# EasyEDA Pro project MasterDesignFileRev2.epro, schematic Schematic1
Board Name: Board1; Create Date: 2025-04-22; Page Name: P1; Project Name: XBOX Console controller fitzgeraldlabs; Schematic Name: Schematic1; Update Date: 2025-04-30; Company: Gneiss Technologies; Drawed: Anik; Drawn: Anik; Page Size: A4; Part Number: GIL-0001; Reviewed: Gneiss Team; Version: V0.1
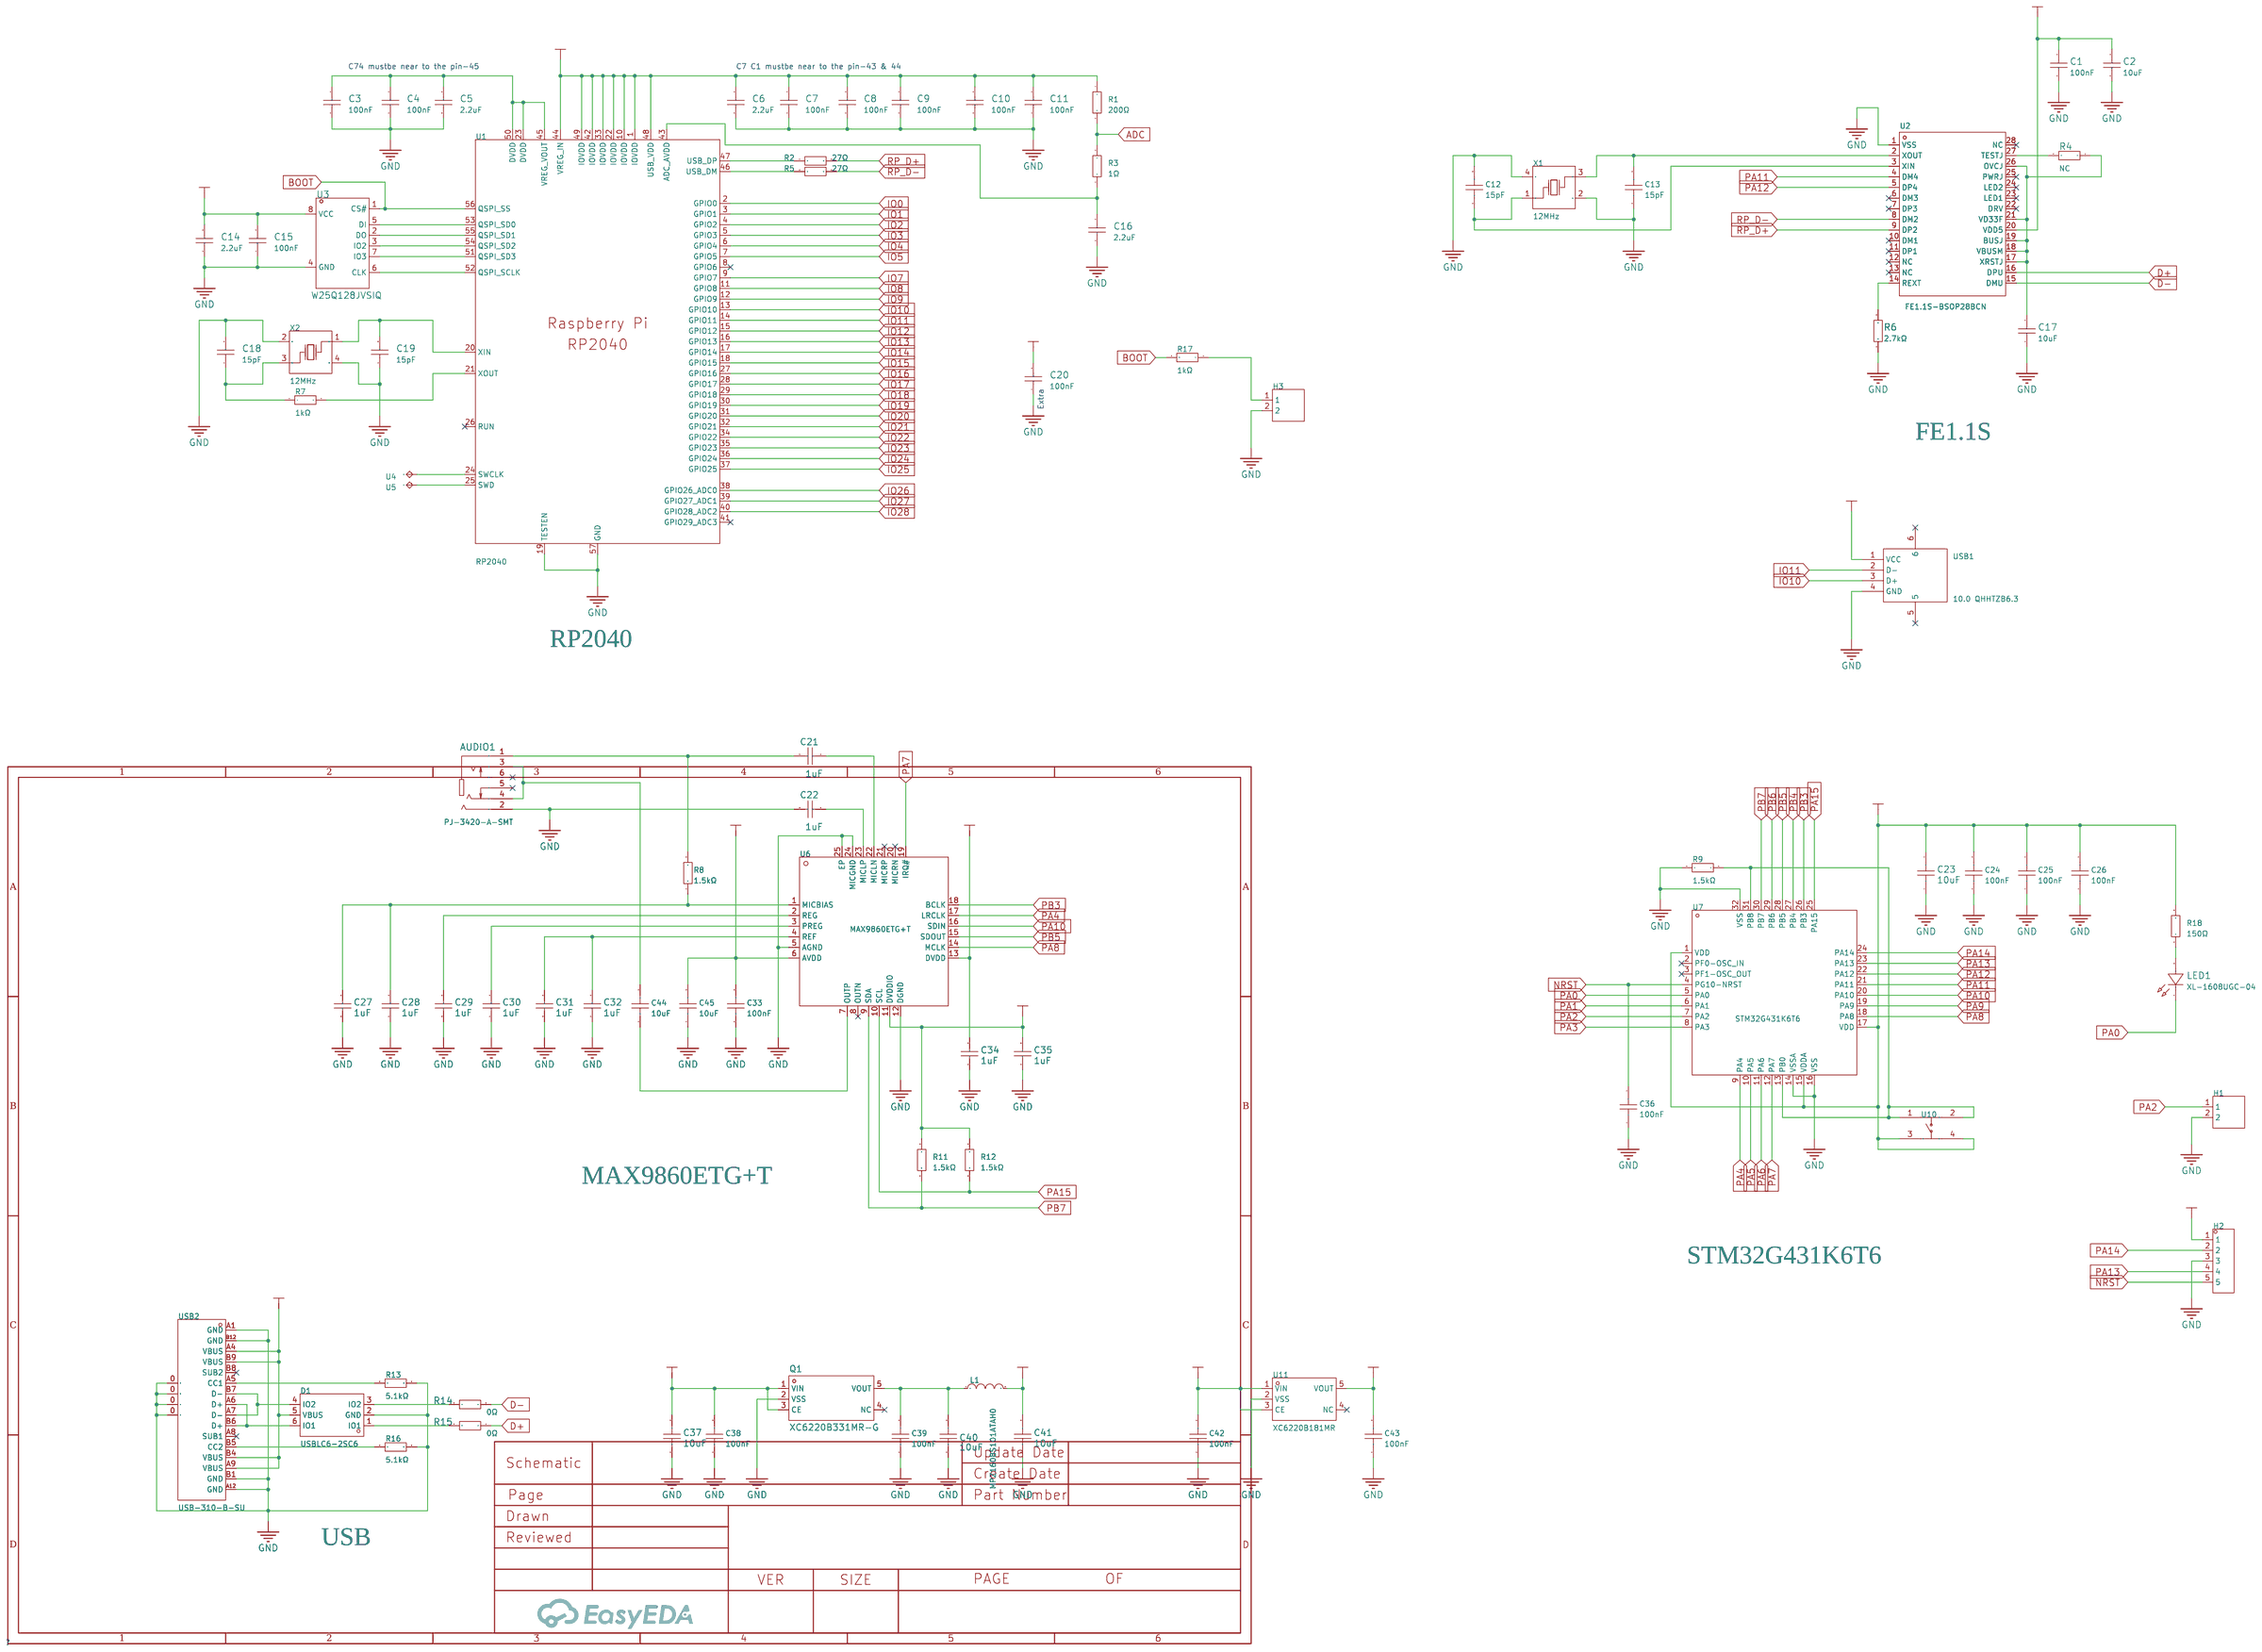
[diagram p0: schematic sheet]

## Parts
AUDIO1  PJ-3420-A-SMT  [AUDIO-SMD_PJ-3420-A-SMT_C319102]
C1  100nF  [C0402]
C2  10uF  [C0402]
C3  100nF  [C0402]
C4  100nF  [C0402]
C5  2.2uF  [C0402]
C6  2.2uF  [C0402]
C7  100nF  [C0402]
C8  100nF  [C0402]
C9  100nF  [C0402]
C10  100nF  [C0402]
C11  100nF  [C0402]
C12  15pF  [C0402]
C13  15pF  [C0402]
C14  2.2uF  [C0402]
C15  100nF  [C0402]
C16  2.2uF  [C0402]
C17  10uF  [C0402]
C18  15pF  [C0402]
C19  15pF  [C0402]
C20  100nF  [C0402]
C21  1uF  [C0402]
C22  1uF  [C0402]
C23  10uF  [C0805]
C24  100nF  [C0402]
C25  100nF  [C0402]
C26  100nF  [C0402]
C27  1uF  [C0402]
C28  1uF  [C0402]
C29  1uF  [C0402]
C30  1uF  [C0402]
C31  1uF  [C0402]
C32  1uF  [C0402]
C33  100nF  [C0402]
C34  1uF  [C0402]
C35  1uF  [C0402]
C36  100nF  [C0402]
C37  10uF  [C0805]
C38  100nF  [C0402]
C39  100nF  [C0402]
C40  10uF  [C0805]
C41  10uF  [C0805]
C42  100nF  [C0402]
C43  100nF  [C0402]
C44  10uF  [C0402]
C45  10uF  [C0402]
D1  USBLC6-2SC6  [SOT-23-6_L2.9-W1.6-P0.95-LS2.8-BL]
H1  -  [HDR-TH_2P-P2.54-V-M-1]  (no BOM)
H2  -  [HDR-TH_5P-P2.54-V-M]  (no BOM)
H3  -  [HDR-TH_2P-P2.54-V-M-1]  (no BOM)
L1  MPZ1608S101ATAH0  [L0603]
LED1  XL-1608UGC-04  [LED0603-RD_GREEN]
Q1  XC6220B331MR-G  [SOT-25_L3.0-W1.6-P0.95-LS2.8-TL]
R1  200Ω  [R0402]
R2  27Ω  [R0402]
R3  1Ω  [R0402]
R4  NC  [R0402]  (no BOM)
R5  27Ω  [R0402]
R6  2.7kΩ  [R0402]
R7  1kΩ  [R0402]
R8  1.5kΩ  [R0402]
R9  1.5kΩ  [R0402]
R11  1.5kΩ  [R0402]
R12  1.5kΩ  [R0402]
R13  5.1kΩ  [R0402]
R14  0Ω  [R0402]
R15  0Ω  [R0402]
R16  5.1kΩ  [R0402]
R17  1kΩ  [R0402]
R18  150Ω  [R0402]
U1  RP2040  [LQFN-56_L7.0-W7.0-P0.4-EP]
U2  FE1.1S-BSOP28BCN  [SSOP-28_L9.9-W3.9-P0.64-LS6.0-BL-1]
U3  W25Q128JVSIQ  [SOP-8_L5.3-W5.3-P1.27-LS8.0-BL]
U4  -  [test pad 1]
U5  -  [test pad 1]
U6  MAX9860ETG+T  [TQFN-24_L4.0-W4.0-P0.50-BL-EP]
U7  STM32G431K6T6  [LQFP-32_L7.0-W7.0-P0.80-LS9.0-BL]
U10  TSC4A 160gf-WZ 016  [KEY-SMD_TSC4A]
U11  XC6220B181MR  [SOT-23-5_L2.9-W1.6-P0.95-LS2.8-BR]
USB1  10.0 QHHTZB6.3  [USB-A-TH_10.0QHHTZB6.3]
USB2  USB-310-B-SU  [USB-C-SMD_20P-P0.50-L7.4-W8.9]
X1  12MHz  [OSC-SMD_4P-L3.2-W2.5-BL]
X2  12MHz  [OSC-SMD_4P-L3.2-W2.5-BL]

## Library data of the parts
AUDIO1 = PJ-3420-A-SMT: Connector Type:3.5mm耳机座 Current Rating (Max):500mA Voltage Rating (Max):30V Operating Temperature Range:-20℃~+70℃ Operating Temperature Range:-20℃~+70℃ Soldering Temperature(Max):235℃; LCSC Part Name: 3.5mm耳机座; Supplier Part: C319102; Manufacturer: XKB Connectivity(中国星坤); Supplier Footprint: SMD; JLCPCB Part Class: Extended Part; Datasheet: https://atta.szlcsc.com/upload/public/pdf/source/20211015/FA11597DF53DC331FB6A72D64BA50234.pdf; Supplier: LCSC; Connector Type: 3.5mm耳机座; Current Rating (Max): 500mA; Voltage Rating (Max): 30V; Operating Temperature Range: -20℃~+70℃; Soldering Temperature(Max): 235℃
C1 C3 C4 C7-C11 C15 C20 C24-C26 C33 C36 C38 C39 C42 C43 = CL05B104KO5NNNC: Capacitance: Tolerance:±10% Tolerance:±10% Voltage Rated: Temperature Coefficient:; LCSC Part Name: 100nF ±10% 16V; Supplier Part: C1525; Manufacturer: SAMSUNG(三星); Supplier Footprint: 0402; JLCPCB Part Class: Basic Part; Datasheet: https://atta.szlcsc.com/upload/public/pdf/source/20160218/1457707763339.pdf; Supplier: LCSC; Tolerance: ±10%
C2 C17 = CL05A106MQ5NUNC: Capacitance: Tolerance:±20% Tolerance:±20% Voltage Rated: Temperature Coefficient:; LCSC Part Name: 10uF ±20% 6.3V; Supplier Part: C15525; Manufacturer: SAMSUNG(三星); Supplier Footprint: 0402; JLCPCB Part Class: Basic Part; Datasheet: https://atta.szlcsc.com/upload/public/pdf/source/20220823/2B02EE04F8F211D38A52DCB16EB6BEBA.pdf; Supplier: LCSC; Tolerance: ±20%
C5 C6 C14 C16 = GRM155R61A225KE95D: Capacitance: Tolerance:±10% Tolerance:±10% Voltage Rated: Temperature Coefficient:; LCSC Part Name: 2.2uF ±10% 10V; Supplier Part: C77002; Manufacturer: muRata(村田); Supplier Footprint: 0402; JLCPCB Part Class: Extended Part; Datasheet: https://atta.szlcsc.com/upload/public/pdf/source/20180326/C77002_D35CAAF23EAD1FF71F41A67C7E29E1B2.pdf; Supplier: LCSC; Tolerance: ±10%
C12 C13 = 0402CG150F500NT: Capacitance: Tolerance:±1% Tolerance:±1% Voltage Rated: Temperature Coefficient:; LCSC Part Name: 15pF ±1% 50V; Supplier Part: C285151; Manufacturer: FH(风华); Supplier Footprint: 0402; JLCPCB Part Class: Extended Part; Datasheet: https://atta.szlcsc.com/upload/public/pdf/source/20200305/C486355_26A10D38EF8C2A5C37091D0039909270.pdf; Supplier: LCSC; Tolerance: ±1%
C18 C19 = 0402CG150J500NT: Capacitance: Tolerance:±5% Tolerance:±5% Voltage Rated: Temperature Coefficient:; LCSC Part Name: 15pF ±5% 50V; Supplier Part: C1548; Manufacturer: FH(风华); Supplier Footprint: 0402; JLCPCB Part Class: Basic Part; Datasheet: https://atta.szlcsc.com/upload/public/pdf/source/20200305/C486355_26A10D38EF8C2A5C37091D0039909270.pdf; Supplier: LCSC; Tolerance: ±5%
C21 C22 C27-C32 C34 C35 = 1uF: link: https://item.szlcsc.com/15869.html; 3DModel: C0402_L1.0-W0.5-H0.5; Supplier: LCSC; Manufacturer: YAGEO(国巨); Manufacturer Part: CC0402KRX5R5BB105; Supplier Part: C106253; JLCPCB Part Class: ExtendedPart
C23 C37 C40 C41 = 10uF: link: https://item.szlcsc.com/373011.html; 3DModel: C0805_L2.0-W1.3-H1.3; Supplier: LCSC; Supplier Part: C669099; Manufacturer: FH(风华); Manufacturer Part: 0805X106M250NT; JLCPCB Part Class: ExtendedPart
C44 C45 = HGC0402R5106M100NTEJ: Capacitance: Tolerance:±20% Tolerance:±20% Voltage Rated: Temperature Coefficient:; LCSC Part Name: 10uF ±20% 10V; Supplier Part: C7472949; Manufacturer: Chinocera(华瓷); Supplier Footprint: 0402; JLCPCB Part Class: Extended Part; Datasheet: https://atta.szlcsc.com/upload/public/pdf/source/20240320/FAC3FEC40A78BC5CCCE96C232A94D860.pdf; Supplier: LCSC; Tolerance: ±20%
D1 = USBLC6-2SC6_C2827654: polarity:- Reverse Stand-Off Voltage (Vrwm):- Maximum Clamping Voltage:- Peak Pulse Current (Ipp)@10/1000us:- Peak Pulse Power Dissipation (Ppp)@10/1000us:- Breakdown Voltage:- Reverse Leakage Current (Ir):- Operating Temperature:- Operating Temperature:-; LCSC Part Name: ESD，可防30kV静电; Supplier Part: C2827654; Manufacturer: TECH PUBLIC(台舟); Supplier Footprint: SOT-23-6; JLCPCB Part Class: Extended Part; Datasheet: https://atta.szlcsc.com/upload/public/pdf/source/20210810/FBD75DE717D6D97BAC6DD7F2B5C09DCD.pdf; Supplier: LCSC; Type: ESD
H1 H3 = HDR-M_2.54_1x2P: Supplier Footprint: Through
H2 = HDR-M_2.54_1x5P: Supplier Footprint: Through
L1 = MPZ1608S101ATAH0: Impedance @ Frequency:100Ω@100MHz Tolerance:±25% Tolerance:±25% DC Resistance:30mΩ Current Rating:3A Circuits:1; LCSC Part Name: 单路 0603磁珠 阻抗100Ω@100MHz; Supplier Part: C107332; Manufacturer: TDK; Supplier Footprint: 0603; JLCPCB Part Class: Extended Part; Datasheet: https://atta.szlcsc.com/upload/public/pdf/source/20170420/1492670791787.pdf; Supplier: LCSC; Impedance @ Frequency: 100Ω@100MHz; Tolerance: ±25%; DC Resistance: 30mΩ; Current Rating: 3A; Circuits: 1
LED1 = XL-1608UGC-04: Lamp Holder Type:- Emitted Color:Emerald Forward Voltage (VF):- Forward Voltage (VF):- Power Dissipation:80mW Forward Current:25mA Dominant Wavelength:516nm~525nm Dominant Wavelength:516nm~525nm Peak Wavelength:534nm Diode Configuration:独立二极管 Lens Color:无; Supplier Part: C965804; Manufacturer: XINGLIGHT(成兴光); Supplier Footprint: 0603; JLCPCB Part Class: Extended Part; Datasheet: https://atta.szlcsc.com/upload/public/pdf/source/20221102/520D6E465E5CFD1609C8A4DBC80D4018.pdf; Supplier: LCSC; Emitted Color: Emerald; Power Dissipation: 80mW; Forward Current: 25mA; Dominant Wavelength: 516nm~525nm; Peak Wavelength: 534nm; Diode Configuration: 独立二极管; Lens Color: 无色透明透镜; Viewing Angle: 120°; Mounting Sytle: Positive post; Operating Temperature: -30℃~+85℃
Q1 = XC6220B331MR-G: link: https://item.szlcsc.com/464949.html; 3DModel: SOT-25-5_L3.0-W1.6-H1.3-LS2.8-P0.95; Supplier: LCSC; Manufacturer: TOREX(特瑞仕); Supplier Part: C86534; JLCPCB Part Class: ExtendedPart
R1 = 0402WGF2000TCE: Type:Thick Film Resistors Resistance: Tolerance:±1% Tolerance:±1% Power(Watts): Temperature Coefficient:±100ppm/℃ Temperature Coefficient:±100ppm/℃ Overload Voltage (Max): Operating Temperature Range:-55℃~+155℃ Operating Temperature Range:-55℃~+155℃; LCSC Part Name: 200Ω±1%62.5mW; Supplier Part: C25087; Manufacturer: UNI-ROYAL(厚声); Supplier Footprint: 0402; JLCPCB Part Class: BasicPart; Datasheet: https://atta.szlcsc.com/upload/public/pdf/source/20200306/C422600_1E6D84923E4A46A82E41ADD87F860B5C.pdf; Supplier: LCSC; Type: ThickFilmResistors; Tolerance: ±1%; Temperature Coefficient: ±100ppm/℃; Operating Temperature Range: -55℃~+155℃
R2 R5 = RC0402FR-0727RL: Tolerance: Power(Watts): Temperature Coefficient: Temperature Coefficient: Resistance: Overload Voltage (Max): Operating Temperature Range: Operating Temperature Range:; LCSC Part Name: 27Ω ±1%; Supplier Part: C138021; Manufacturer: YAGEO(国巨); Supplier Footprint: 0402; JLCPCB Part Class: Extended Part; Datasheet: https://atta.szlcsc.com/upload/public/pdf/source/20171107/C138021_15100516446891096947.pdf; Supplier: LCSC
R3 = 0402WGF100KTCE: Type:Thick Film Resistors Resistance: Tolerance:±1% Tolerance:±1% Power(Watts): Temperature Coefficient:±200ppm/℃ Temperature Coefficient:±200ppm/℃ Overload Voltage (Max): Operating Temperature Range:-55℃~+155℃ Operating Temperature Range:-55℃~+155℃; LCSC Part Name: 1Ω±1%62.5mW; Supplier Part: C25086; Manufacturer: UNI-ROYAL(厚声); Supplier Footprint: 0402; JLCPCB Part Class: BasicPart; Datasheet: https://atta.szlcsc.com/upload/public/pdf/source/20200306/C422600_1E6D84923E4A46A82E41ADD87F860B5C.pdf; Supplier: LCSC; Type: ThickFilmResistors; Tolerance: ±1%; Temperature Coefficient: ±200ppm/℃; Operating Temperature Range: -55℃~+155℃
R4 R6 = 0402WGF2701TCE: Type:Thick Film Resistors Resistance:2.7kΩ Tolerance:±1% Tolerance:±1% Power(Watts): Overload Voltage (Max): Temperature Coefficient:±100ppm/℃ Temperature Coefficient:±100ppm/℃ Operating Temperature Range:-55℃~+155℃ Operating Temperature Range:-55℃~+155℃; LCSC Part Name: 2.7kΩ ±1% 62.5mW 厚膜电阻; Supplier Part: C25885; Manufacturer: UNI-ROYAL(厚声); Supplier Footprint: 0402; JLCPCB Part Class: Extended Part; Datasheet: https://atta.szlcsc.com/upload/public/pdf/source/20200306/C422600_1E6D84923E4A46A82E41ADD87F860B5C.pdf; Supplier: LCSC; Type: Thick Film Resistors; Tolerance: ±1%; Temperature Coefficient: ±100ppm/℃; Operating Temperature Range: -55℃~+155℃
R7 R17 = RC0402FR-071KL: Type:Thick Film Resistors Resistance: Tolerance:±1% Tolerance:±1% Power(Watts): Temperature Coefficient:±100ppm/℃ Temperature Coefficient:±100ppm/℃ Overload Voltage (Max): Operating Temperature Range:-55℃~+155℃ Operating Temperature Range:-55℃~+155℃; LCSC Part Name: 1kΩ ±1% 62.5mW; Supplier Part: C106235; Manufacturer: YAGEO(国巨); Supplier Footprint: 0402; JLCPCB Part Class: Extended Part; Datasheet: https://atta.szlcsc.com/upload/public/pdf/source/20170518/1495085714666.pdf; Supplier: LCSC; Type: Thick Film Resistors; Tolerance: ±1%; Temperature Coefficient: ±100ppm/℃; Operating Temperature Range: -55℃~+155℃
R8 R9 R11 R12 = RC0402FR-071K5L: Type:Thick Film Resistors Resistance: Tolerance:±1% Tolerance:±1% Power(Watts): Overload Voltage (Max): Temperature Coefficient:±100ppm/℃ Temperature Coefficient:±100ppm/℃ Operating Temperature Range:-55℃~+155℃ Operating Temperature Range:-55℃~+155℃; LCSC Part Name: 厚膜电阻 1.5kΩ ±1% 62.5mW; Supplier Part: C114759; Manufacturer: YAGEO(国巨); Supplier Footprint: 0402; JLCPCB Part Class: Extended Part; Datasheet: https://atta.szlcsc.com/upload/public/pdf/source/20180821/C275644_0D56F95EFF785E7D9A1FEF436B37DA78.pdf; Supplier: LCSC; Type: Thick Film Resistors; Tolerance: ±1%; Temperature Coefficient: ±100ppm/℃; Operating Temperature Range: -55℃~+155℃
R13 R16 = 0402WGF5101TCE: Type:Thick Film Resistors Resistance:5.1kΩ Tolerance:±1% Tolerance:±1% Power(Watts): Overload Voltage (Max): Temperature Coefficient:±100ppm/℃ Temperature Coefficient:±100ppm/℃ Operating Temperature Range:-55℃~+155℃ Operating Temperature Range:-55℃~+155℃; LCSC Part Name: 5.1kΩ ±1% 62.5mW 厚膜电阻; Supplier Part: C25905; Manufacturer: UNI-ROYAL(厚声); Supplier Footprint: 0402; JLCPCB Part Class: Basic Part; Datasheet: https://atta.szlcsc.com/upload/public/pdf/source/20200306/C422600_1E6D84923E4A46A82E41ADD87F860B5C.pdf; Supplier: LCSC; Type: Thick Film Resistors; Tolerance: ±1%; Temperature Coefficient: ±100ppm/℃; Operating Temperature Range: -55℃~+155℃
R14 R15 = 0402WGF0000TCE: Type:Thick Film Resistors Resistance: Tolerance:±1% Tolerance:±1% Power(Watts): Overload Voltage (Max): Temperature Coefficient:±800ppm/℃ Temperature Coefficient:±800ppm/℃ Operating Temperature Range:-55℃~+155℃ Operating Temperature Range:-55℃~+155℃; LCSC Part Name: 0Ω ±1% 62.5mW 厚膜电阻; Supplier Part: C17168; Manufacturer: UNI-ROYAL(厚声); Supplier Footprint: 0402; JLCPCB Part Class: Basic Part; Datasheet: https://atta.szlcsc.com/upload/public/pdf/source/20200306/C422600_1E6D84923E4A46A82E41ADD87F860B5C.pdf; Supplier: LCSC; Type: Thick Film Resistors; Tolerance: ±1%; Temperature Coefficient: ±800ppm/℃; Operating Temperature Range: -55℃~+155℃
R18 = RC0402FR-07150RL: Type:Thick Film Resistors Resistance: Tolerance:±1% Tolerance:±1% Power(Watts): Overload Voltage (Max): Temperature Coefficient:±100ppm/℃ Temperature Coefficient:±100ppm/℃ Operating Temperature Range:-55℃~+155℃ Operating Temperature Range:-55℃~+155℃; LCSC Part Name: 厚膜电阻 150Ω ±1% 62.5mW; Supplier Part: C138054; Manufacturer: YAGEO(国巨); Supplier Footprint: 0402; JLCPCB Part Class: Extended Part; Datasheet: https://atta.szlcsc.com/upload/public/pdf/source/20180821/C275644_0D56F95EFF785E7D9A1FEF436B37DA78.pdf; Supplier: LCSC; Type: Thick Film Resistors; Tolerance: ±1%; Temperature Coefficient: ±100ppm/℃; Operating Temperature Range: -55℃~+155℃
U1 = RP2040_C2040: Application Area:- CPU Core:ARM-MSeries CPU Maximum Speed:133MHz Operating Voltage Range:- Operating Voltage Range:- Program Storage Size:- Program Memory Type:- RAM Size:264KB EEPROM:- GPIO Ports Number:30 ADC (Bit):12bit DAC (Bit):- PWM (Bit):- 8Bit Tim; LCSC Part Name: ARM-M系列133MHz; Supplier Part: C2040; Manufacturer: RaspberryPi(树莓派); Supplier Footprint: LQFN-56(7x7); JLCPCB Part Class: ExtendedPart; Datasheet: https://atta.szlcsc.com/upload/public/pdf/source/20210621/C2040_96F425825606B7957D87DD32E2512CA9.pdf; Supplier: LCSC; CPU Core: ARM-MSeries; CPU Maximum Speed: 133MHz; RAM Size: 264KB; GPIO Ports Number: 30; ADC (Bit): 12bit; UART/USART: 2; I2C: 2; SPI: 2; Universal Serial Bus: 有; Peripheral/Function: DMA；PWM; Direct Memory Access: 有
U2 = FE1.1S-BSOP28BCN: Applications Function: Protocol:; LCSC Part Name: FE1.1S-BSOP28BCN USB 2.0高速4端口集线器控制器; Supplier Part: C9359; Manufacturer: TERMINUS; Supplier Footprint: SSOP-28-150mil; JLCPCB Part Class: Extended Part; Datasheet: https://atta.szlcsc.com/upload/public/pdf/source/20230317/CF3CD0767291E55840676FE9156E5488.pdf; Supplier: LCSC
U3 = W25Q128JVSIQ: link: https://item.szlcsc.com/406246.html; 3DModel: SOP-8_L5.2-W5.3-H2.1-LS7.9-P1.27; Supplier: LCSC; Manufacturer: WINBOND(华邦); Supplier Part: C113767; JLCPCB Part Class: ExtendedPart
U4 U5 = testpad_TP_TP14SQ
U6 = MAX9860ETG+T: Type:Codec Interface:I2C Sampling Frequency:8kHz~48kHz Sampling Frequency:8kHz~48kHz Supply Voltage:- Supply Voltage:- Operating Temperature:-40℃~+85℃ Operating Temperature:-40℃~+85℃; LCSC Part Name: 16位单声道音频语音编解码器; Supplier Part: C516787; Manufacturer: ADI(亚德诺)/MAXIM(美信); Supplier Footprint: TQFN-24-EP(4x4); JLCPCB Part Class: Extended Part; Datasheet: https://atta.szlcsc.com/upload/public/pdf/source/20200421/C516787_629DDBC1BE8613382AAD5307EE629BFC.pdf; Supplier: LCSC; Type: Codec; Interface: I2C; Sampling Frequency: 8kHz~48kHz; Operating Temperature: -40℃~+85℃
U7 = STM32G431K6T6: CPU Core:ARM-M4 CPU Maximum Speed:170MHz Program Storage Size:32KB Number of I/O:26 ADC (Bit):12bit DAC (Bit):12bit Voltage - Supply:1.71V~3.6V Voltage - Supply:1.71V~3.6V Applications:-; LCSC Part Name: 带DSP和FPU的170MHz主流ARM Cortex-M4 MCU，具有32 KB Flash存储器、数学加速器和中等模拟电平集成; Supplier Part: C730097; Manufacturer: ST(意法半导体); Supplier Footprint: LQFP-32(7x7); JLCPCB Part Class: Extended Part; Datasheet: https://atta.szlcsc.com/upload/public/pdf/source/20200902/C730096_BFCD20E6BEC60EDD56B8D75B9D9F0D4C.pdf; Supplier: LCSC; CPU Core: ARM-M4; CPU Maximum Speed: 170MHz; Program Storage Size: 32KB; Number of I/O: 26; ADC (Bit): 12bit; DAC (Bit): 12bit; Voltage - Supply: 1.71V~3.6V
U10 = TSC4A 160gf-WZ 016: Circuit:SPST Actuator Style:Rectangle button Operating Force:160gf Mounting Style:卧贴 Switch Length:3.5mm Switch Height:1.5mm Contact Current:50mA Voltage Rating (DC):12V Insulation Resistance:100MΩ Actuator/Cap Color:Black Pin Style:SMDSplicing Mechanical; LCSC Part Name: 轻触开关 侧按四脚小龟 160gf无定位柱 贴膜; Supplier Part: C2906284; Manufacturer: SHOU HAN(首韩); Supplier Footprint: SMD; JLCPCB Part Class: Extended Part; Datasheet: https://atta.szlcsc.com/upload/public/pdf/source/20211019/A30929F27AFADC19C8B53860DA406C04.pdf; Supplier: LCSC; Circuit: SPST; Actuator Style: Rectangle button; Operating Force: 160gf; Mounting Style: 卧贴; Switch Length: 3.5mm; Switch Height: 1.5mm; Contact Current: 50mA; Voltage Rating (DC): 12V; Insulation Resistance: 100MΩ; Actuator/Cap Color: Black; Pin Style: SMDSplicing; Mechanical Life: 10万次; Operating Temperature: -20℃~+70℃
U11 = XC6220B181MR: Output Type:Fixed Voltage - Supply:7V Output Voltage:1.8V Output Voltage:1.8V Output Current:300mA; LCSC Part Name: 线性稳压器(LDO); Supplier Part: C22466447; Manufacturer: TDSEMIC(拓电半导体); Supplier Footprint: SOT-23-5; JLCPCB Part Class: Extended Part; Datasheet: https://atta.szlcsc.com/upload/public/pdf/source/20240705/B49D1CA359A91AAC39E0A562B1C6DB33.pdf; Supplier: LCSC; Output Type: Fixed; Voltage - Supply: 7V; Output Voltage: 1.8V; Output Current: 300mA
USB1 = 10.0 QHHTZB6.3: Connector Type:Type-A Standard:USB 2.0 Gender:Mother Mounting Style:Horizontal attachment Number of Contacts:4P Number of Ports:1 Current Rating - Power (Max):1.5A Rated Voltage (Max):30V Connect-Disconnect Life:5000 Cuts Supplementary Features:- Center H; LCSC Part Name: Type-A 母 卧贴; Supplier Part: C668591; Manufacturer: SHOU HAN(首韩); Supplier Footprint: SMD; JLCPCB Part Class: Extended Part; Datasheet: https://atta.szlcsc.com/upload/public/pdf/source/20200618/C668591_4974797655F912CB13E5351AD3DDB1B7.pdf; Supplier: LCSC; Connector Type: Type-A; Standard: USB 2.0; Gender: Mother; Mounting Style: Horizontal attachment; Number of Contacts: 4P; Number of Ports: 1; Current Rating - Power (Max): 1.5A; Rated Voltage (Max): 30V; Connect-Disconnect Life: 5000 Cuts; Length: 10mm; Core Colour: Black; Operating Temperature Range: -25℃~+85℃
USB2 = USB-310-B-SU: Connector Type:Type-C Standard:- Gender:Female Number of Ports:1 Number of Contacts:- Mounting Style:卧贴 Current Rating - Power (Max):3A Contact Material:- Contact Plating:- Operating Temperature Range:-20℃~+60℃ Operating Temperature Range:-20℃~+60℃ Solder; LCSC Part Name: Type-C 母 卧贴; Supplier Part: C309347; Manufacturer: HOOYA(皓宇电子); Supplier Footprint: SMD; JLCPCB Part Class: Extended Part; Datasheet: https://atta.szlcsc.com/upload/public/pdf/source/20181114/C309347_086B829E74D68FC76D369103D663A043.pdf; Supplier: LCSC; Connector Type: Type-C; Gender: Female; Number of Ports: 1; Mounting Style: 卧贴; Current Rating - Power (Max): 3A; Operating Temperature Range: -20℃~+60℃
X1 X2 = X322512MSB4SI: Crystal Type:SMD Crystal Resonator Frequency: Frequency Tolerance:±10ppm Frequency Tolerance:±10ppm Frequency Stability:±30ppm Frequency Stability:±30ppm Load Capacitance: Operating Temperature: Operating Temperature:; LCSC Part Name: 12MHz±10ppm20pFYSX321SL; Supplier Part: C9002; Manufacturer: YXC(扬兴晶振); Supplier Footprint: SMD3225-4P; JLCPCB Part Class: BasicPart; Datasheet: https://atta.szlcsc.com/upload/public/pdf/source/20210329/C112971_1F611BDC486E193C1706F6D8EB5AA189.pdf; Supplier: LCSC; Crystal Type: SMDCrystalResonator; Frequency Tolerance: ±10ppm; Frequency Stability: ±30ppm

## Nets
+1.8V: C33.2 C34.2 C43.2 C45.2 U6.6(AVDD) U6.13(DVDD) U11.5(VOUT)
+3.3V: C6.2 C7.2 C8.2 C9.2 C10.2 C11.2 C14.2 C15.2 C20.2 C23.2 C24.2 C25.2 C26.2 C35.2 C41.2 C42.2 H2.1 L1.2 R1.1 R11.1 R12.1 R18.2 U1.1(IOVDD) U1.10(IOVDD) U1.22(IOVDD) U1.33(IOVDD) U1.42(IOVDD) U1.44(VREG_IN) U1.48(USB_VDD) U1.49(IOVDD) U3.8(VCC) U6.11(DVDDIO) U7.1(VDD) U7.15(VDDA) U7.17(VDD) U10.3 U10.4 U11.1(VIN) U11.3(CE)
GND: AUDIO1.2 C1.1 C2.1 C3.1 C4.1 C5.1 C6.1 C7.1 C8.1 C9.1 C10.1 C11.1 C12.2 C13.1 C14.1 C15.1 C16.1 C17.1 C18.2 C19.1 C20.1 C22.2 C23.1 C24.1 C25.1 C26.1 C27.1 C28.1 C29.1 C30.1 C31.1 C32.1 C33.1 C34.1 C35.1 C36.1 C37.1 C38.1 C39.1 C40.1 C41.1 C42.1 C43.1 C45.1 D1.2(GND) H1.2 H2.3 H3.2 Q1.2(VSS) R6.1 R9.2 R13.2 R16.2 U1.19(TESTEN) U1.57(GND) U2.1(VSS) U3.4(GND) U6.5(AGND) U6.12(DGND) U6.24(MICGND) U6.25(EP) U7.14(VSSA) U7.16(VSS) U7.32(VSS) U11.2(VSS) USB1.4(GND) USB2.0 USB2.A1(GND) USB2.A12(GND) USB2.B1(GND) USB2.B12(GND) X1.2(GND) X1.4(GND) X2.2(GND) X2.4(GND)
VBUS: C1.2 C2.2 C37.2 C38.2 D1.5(VBUS) Q1.1(VIN) Q1.3(CE) U2.20(VDD5) USB1.1(VCC) USB2.A4(VBUS) USB2.A9(VBUS) USB2.B4(VBUS) USB2.B9(VBUS)
ADC: R1.2 R3.2
BOOT: R17.2 U1.56(QSPI_SS) U3.1(CS#)
D+: R15.1 U2.16(DPU)
D-: R14.1 U2.15(DMU)
IO0: U1.2(GPIO0)
IO1: U1.3(GPIO1)
IO2: U1.4(GPIO2)
IO3: U1.5(GPIO3)
IO4: U1.6(GPIO4)
IO5: U1.7(GPIO5)
IO7: U1.9(GPIO7)
IO8: U1.11(GPIO8)
IO9: U1.12(GPIO9)
IO10: U1.13(GPIO10) USB1.3(D+)
IO11: U1.14(GPIO11) USB1.2(D-)
IO12: U1.15(GPIO12)
IO13: U1.16(GPIO13)
IO14: U1.17(GPIO14)
IO15: U1.18(GPIO15)
IO16: U1.27(GPIO16)
IO17: U1.28(GPIO17)
IO18: U1.29(GPIO18)
IO19: U1.30(GPIO19)
IO20: U1.31(GPIO20)
IO21: U1.32(GPIO21)
IO22: U1.34(GPIO22)
IO23: U1.35(GPIO23)
IO24: U1.36(GPIO24)
IO25: U1.37(GPIO25)
IO26: U1.38(GPIO26_ADC0)
IO27: U1.39(GPIO27_ADC1)
IO28: U1.40(GPIO28_ADC2)
NRST: C36.2 H2.5 U7.4(PG10-NRST)
PA0: LED1.1(K) U7.5(PA0)
PA1: U7.6(PA1)
PA2: H1.1 U7.7(PA2)
PA3: U7.8(PA3)
PA4: U6.17(LRCLK) U7.9(PA4)
PA5: U7.10(PA5)
PA6: U7.11(PA6)
PA7: U6.19(IRQ#) U7.12(PA7)
PA8: U6.14(MCLK) U7.18(PA8)
PA9: U7.19(PA9)
PA10: U6.16(SDIN) U7.20(PA10)
PA11: U2.4(DM4) U7.21(PA11)
PA12: U2.5(DP4) U7.22(PA12)
PA13: H2.4 U7.23(PA13)
PA14: H2.2 U7.24(PA14)
PA15: R12.2 U6.10(SCL) U7.25(PA15)
PB3: U6.18(BCLK) U7.26(PB3)
PB4: U7.27(PB4)
PB5: U6.15(SDOUT) U7.28(PB5)
PB6: U7.29(PB6)
PB7: R11.2 U6.9(SDA) U7.30(PB7)
RP_D+: R2.2 U2.9(DP2)
RP_D-: R5.2 U2.8(DM2)
$1N1326: C13.2 U2.2(XOUT) X1.3(OSC2)
$1N1327: C12.1 U2.3(XIN) X1.1(OSC1)
$1N1330: R6.2 U2.14(REXT)
$1N1333: C17.2 R4.1 U2.17(XRSTJ) U2.18(VBUSM) U2.19(BUSJ) U2.21(VD33F) U2.26(OVCJ)
$1N1341: R4.2 U2.27(TESTJ)
$1N2819: U1.54(QSPI_SD2) U3.3(IO2)
$1N2820: U1.55(QSPI_SD1) U3.2(DO)
$1N2821: U1.53(QSPI_SD0) U3.5(DI)
$1N2822: U1.52(QSPI_SCLK) U3.6(CLK)
$1N2823: U1.51(QSPI_SD3) U3.7(IO3)
$1N2826: R7.2 U1.21(XOUT)
$1N2831: R2.1 U1.47(USB_DP)
$1N2832: R5.1 U1.46(USB_DM)
$1N2835: U1.24(SWCLK) U4.1
$1N2836: U1.25(SWD) U5.1
$1N2868: C16.2 R3.1 U1.43(ADC_AVDD)
$1N2869: C3.2 C4.2 C5.2 U1.23(DVDD) U1.45(VREG_VOUT) U1.50(DVDD)
$1N2871: C19.2 U1.20(XIN) X2.1(OSC1)
$1N2872: C18.1 R7.1 X2.3(OSC2)
$1N8823: R16.1 USB2.B5(CC2)
$1N8824: D1.6(IO1) USB2.A6(D+) USB2.B6(D+)
$1N8825: D1.4(IO2) USB2.A7(D-) USB2.B7(D-)
$1N8826: R13.1 USB2.A5(CC1)
$1N8828: D1.3(IO2) R14.2
$1N8829: D1.1(IO1) R15.2
$1N9520: C39.2 C40.2 L1.1 Q1.5(VOUT)
$1N10211: C31.2 C32.2 U6.4(REF)
$1N10390: C27.2 C28.2 R8.1 U6.1(MICBIAS)
$1N10572: C29.2 U6.2(REG)
$1N10576: C30.2 U6.3(PREG)
$1N10655: C22.1 U6.23(MICLP)
$1N10660: C21.1 U6.22(MICLN)
$1N10709: AUDIO1.1 C21.2 R8.2
$1N10766: C44.1 U6.7(OUTP)
$1N10774: AUDIO1.3 AUDIO1.4 C44.2
$1N11459: R9.1 U7.13(PB0) U7.31(PB8) U10.1 U10.2
$1N27069: H3.1 R17.1
$1N27660: LED1.2(A) R18.1

Not connected (* = marked no-connect by the designer): AUDIO1 5* 6*; Q1 4(NC)*; U1 8(GPIO6)* 26(RUN)* 41(GPIO29_ADC3)*; U2 6(DM3)* 7(DP3)* 10(DM1)* 11(DP1)* 12(NC)* 13(NC)* 22(DRV)* 23(LED1)* 24(LED2)* 25(PWRJ)* 28(NC)*; U6 8(OUTN)* 20(MICRN)* 21(MICRP)*; U7 2(PF0-OSC_IN)* 3(PF1-OSC_OUT)*; U11 4(NC)*; USB1 5* 6*; USB2 A8(SUB1)* B8(SUB2)*

## Notes on the sheet
- C74 mustbe near to the pin-45
- C7 C1 mustbe near to the pin-43 & 44
- Extra
- FE1.1S
- RP2040
- MAX9860ETG+T
- STM32G431K6T6
- USB
